# Altium schematic sheet PSU.Schematic.SchDoc
size A
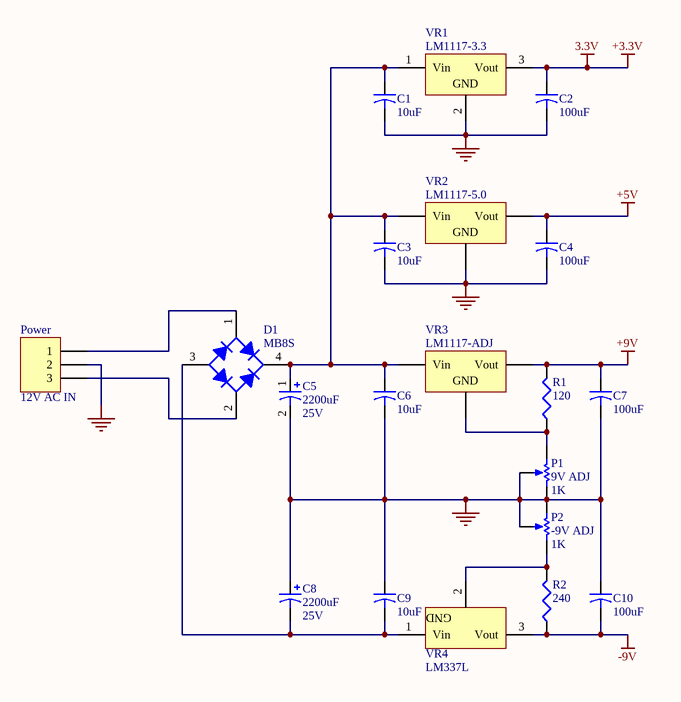
[diagram p0: PSU.Schematic.SchDoc]

## Parts
C1  10uF  [CAPC1608N]
C2  100uF  [CAPC1608N]
C3  10uF  [CAPC1608N]
C4  100uF  [CAPC1608N]
C5  2200uF  value 25V  [Condo electro 13]
C6  10uF  [CAPC1608N]
C7  100uF  [CAPC1608N]
C8  2200uF  value 25V  [Condo electro 13]
C9  10uF  [CAPC1608N]
C10  100uF  [CAPC1608N]
D1  MB8S  [MB8S]
P1  9V ADJ  value 1K  [BOURNS Trim pot]
P2  -9V ADJ  value 1K  [BOURNS Trim pot]
Power  12V AC IN  [Header 3]
R1  120  [CAPC1608N]
R2  240  [CAPC1608N]
VR1  LM1117-3.3  [LM1117-SOT]
VR2  LM1117-5.0  [LM1117-SOT]
VR3  LM1117-ADJ  [LM1117-SOT]
VR4  LM337L  [LM337L]

## Nets
+3.3V: C2.1 VR1.3(Vout)  [also labelled 3.3V]
+5V: C4.1 VR2.3(Vout)
+9V: C7.1 R1.2 VR3.3(Vout)
-9V: C10.2 R2.1 VR4.3(Vout)
GND: C1.2 C2.2 C3.2 C4.2 C5.2 C6.2 C7.2 C8.1 C9.1 C10.1 P1.1(TOP) P1.3(TAP) P2.2(BOT) P2.3(TAP) Power.2 VR1.2(GND) VR2.2(GND)
NetC1_1: C1.1 C3.1 C5.1 C6.1 D1.4(K) VR1.1(Vin) VR2.1(Vin) VR3.1(Vin)
NetC8_2: C8.2 C9.2 D1.3(A) VR4.1(Vin)
NetD1_1: D1.1(C) Power.1
NetD1_2: D1.2(C) Power.3
NetP1_2: P1.2(BOT) R1.1 VR3.2(ADJ)
NetP2_1: P2.1(TOP) R2.2 VR4.2(ADJ)

## Notes on the sheet
- (in symbol Volt Reg) GND

## Library data of the parts
C1 C3 C6 C9 = Cap2: Capacitor; Value: 10u; Published: 23-Sep-2002; PackageReference: CAPR5-4X5; Publisher: Altium Limited; PackageDescription: Capacitor; 2 Leads
C2 C4 C7 C10 = Cap2: Capacitor; Value: 100u; Published: 23-Sep-2002; PackageReference: CAPR5-4X5; Publisher: Altium Limited; PackageDescription: Capacitor; 2 Leads
C5 C8 = Cap Pol1: Polarized Capacitor (Radial); Published: 8-Jun-2000; LatestRevisionDate: 17-Jul-2002; LatestRevisionNote: Re-released for DXP Platform.; PackageReference: RB7.6-15; Publisher: Altium Limited; PackageDescription: Polarized Capacitor (Radial); 2 Leads
D1 = Bridge1: Full Wave Diode Bridge; Fabricant: MULTICOMP; Published: 8-Jun-2000; LatestRevisionDate: 29-May-2009; LatestRevisionNote: Sch pins A & K swapped.; DatasheetVersion: E2732B; PackageReference: D-38; Publisher: Altium Limited; PackageDescription: Bridge Rectifier; 4 Terminals; Body 9.4 x 9.4 mm (typ); Pitch 5.08 mm; Datasheet: http://www.farnell.com/datasheets/1441729.pdf; Ref_Farnell: 1861520; Ref_Fabricant: MB8S
P1 P2 = RPot: Potentiometer; Sim Note: Enter the Resistance value and the set point into parameter fields.; Set Position: 0.5; Published: 8-Jun-2000; LatestRevisionDate: 17-Jul-2002; LatestRevisionNote: Re-released for DXP Platform.; PackageReference: VR5; Publisher: Altium Limited; PackageDescription: Variable Resistor, Thru-Hole; 3 Leads
Power = Header 3: Header, 3-Pin; Fabricant: Lumberg; Ref_Fabricant: NEB 21 R; LatestRevisionDate: 17-Jul-2002; LatestRevisionNote: Re-released for DXP Platform.; Publisher: Altium Limited; Datasheet: http://www.farnell.com/datasheets/1700582.pdf; Ref_Farnell: 1217037
R1 R2 = Res3: Resistor; Published: 8-Jun-2000; LatestRevisionDate: 29-May-2009; LatestRevisionNote: IPC-7351 Footprint Added.; PackageReference: J1-0603; Publisher: Altium Limited; PackageDescription: Chip Resistor
  R1: Value: 120
  R2: Value: 240
VR1 = Volt Reg: Voltage Regulator; Ref_Fabricant: LM1117MPX-3.3/NOPB; Fabricant: Texas Instruments; Published: 24-Mar-1999; LatestRevisionDate: 29-May-2009; LatestRevisionNote: IPC-7351 Footprint Added.; PackageReference: D2PAK; Publisher: Altium Limited; PackageDescription: 3-Pin Transistor Outline Package 2.54 mm Pitch, 15.1 mm Lead Span; Ref_Farnell: 2323580; Datasheet: http://www.farnell.com/datasheets/2019100.pdf
VR2 = Volt Reg: Voltage Regulator; Ref_Fabricant: LM1117MPX-5.0/NOPB; Fabricant: Texas Instruments; Published: 24-Mar-1999; LatestRevisionDate: 29-May-2009; LatestRevisionNote: IPC-7351 Footprint Added.; PackageReference: D2PAK; Publisher: Altium Limited; PackageDescription: 3-Pin Transistor Outline Package 2.54 mm Pitch, 15.1 mm Lead Span; Datasheet: http://www.farnell.com/datasheets/2019100.pdf; Ref_Farnell: 2323572
VR3 = Volt Reg: Voltage Regulator; Published: 24-Mar-1999; LatestRevisionDate: 29-May-2009; LatestRevisionNote: IPC-7351 Footprint Added.; PackageReference: D2PAK; Publisher: Altium Limited; PackageDescription: 3-Pin Transistor Outline Package 2.54 mm Pitch, 15.1 mm Lead Span
VR4 = Volt Reg: Voltage Regulator; Fabricant: Texas Instruments; Ref_Fabricant: LM337LM/NOPB; Published: 24-Mar-1999; LatestRevisionDate: 29-May-2009; LatestRevisionNote: IPC-7351 Footprint Added.; PackageReference: D2PAK; Publisher: Altium Limited; PackageDescription: 3-Pin Transistor Outline Package 2.54 mm Pitch, 15.1 mm Lead Span; Ref_Farnell: 1469092; Datasheet: http://www.farnell.com/datasheets/1972825.pdf